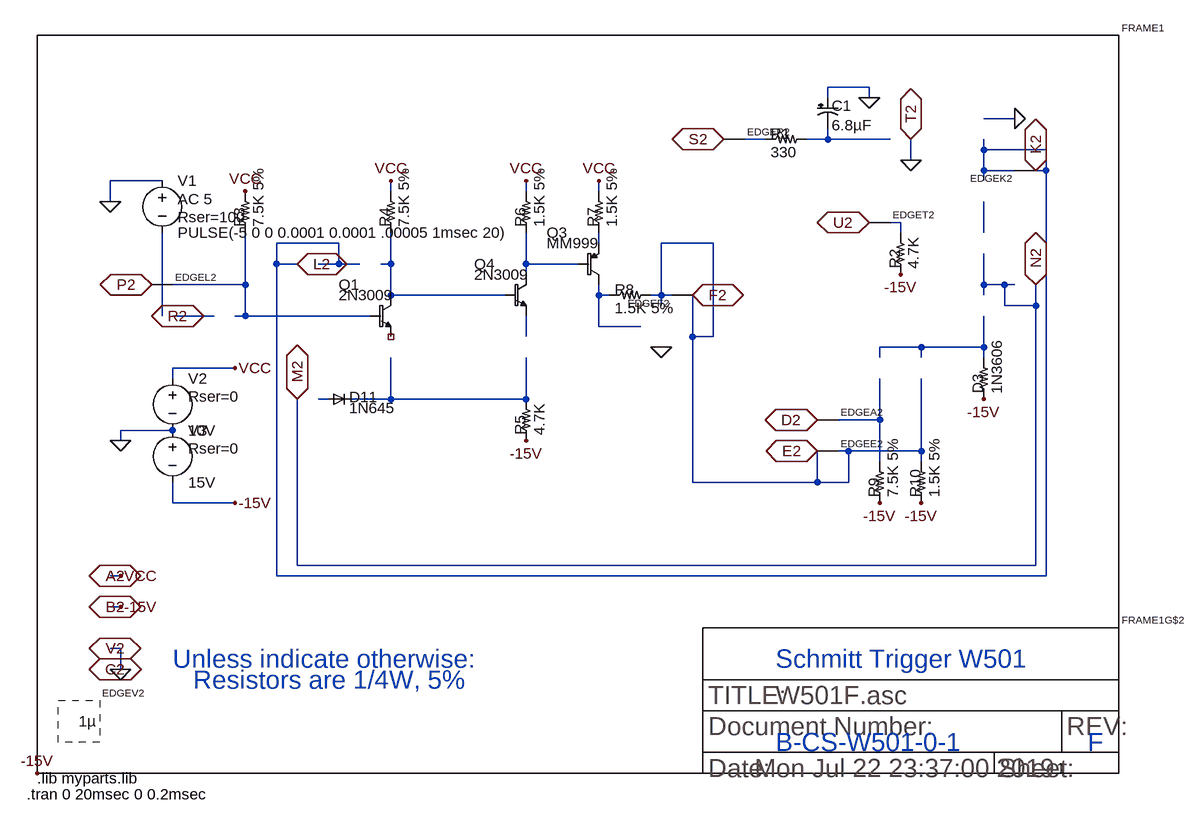
[diagram p0: schematic W501F.asc]
W501F.asc, the LTspice schematic file:
Version 4
SHEET 1 1916 48
WIRE 1280 -1056 1216 -1056
WIRE 1216 -1040 1216 -1056
WIRE 1280 -1040 1280 -1056
WIRE 1504 -1008 1456 -1008
WIRE 1120 -976 1088 -976
WIRE 1216 -976 1216 -992
WIRE 1216 -976 1184 -976
WIRE 1312 -976 1216 -976
WIRE 1456 -960 1456 -976
WIRE 1552 -960 1456 -960
WIRE 1344 -944 1344 -976
WIRE 1456 -928 1456 -960
WIRE 1504 -928 1456 -928
WIRE 1552 -928 1552 -960
WIRE 1552 -928 1536 -928
WIRE 192 -912 112 -912
WIRE 1456 -912 1456 -928
WIRE 544 -896 544 -912
WIRE 752 -896 752 -912
WIRE 864 -896 864 -912
WIRE 112 -880 112 -912
WIRE 1328 -848 1312 -848
WIRE 1328 -832 1328 -848
WIRE 1456 -832 1456 -880
WIRE 464 -816 368 -816
WIRE 864 -816 864 -832
WIRE 1040 -816 960 -816
WIRE 368 -784 368 -816
WIRE 400 -784 368 -784
WIRE 464 -784 464 -816
WIRE 464 -784 432 -784
WIRE 496 -784 464 -784
WIRE 544 -784 544 -832
WIRE 544 -784 528 -784
WIRE 752 -784 752 -832
WIRE 832 -784 752 -784
WIRE 752 -768 752 -784
WIRE 320 -752 320 -832
WIRE 320 -752 208 -752
WIRE 1456 -752 1456 -800
WIRE 1488 -752 1456 -752
WIRE 1504 -752 1488 -752
WIRE 544 -736 544 -784
WIRE 720 -736 544 -736
WIRE 864 -736 864 -752
WIRE 880 -736 864 -736
WIRE 960 -736 960 -816
WIRE 960 -736 944 -736
WIRE 976 -736 960 -736
WIRE 1456 -736 1456 -752
WIRE 960 -720 960 -736
WIRE 1488 -720 1488 -752
WIRE 1536 -720 1536 -752
WIRE 1536 -720 1488 -720
WIRE 192 -704 192 -832
WIRE 272 -704 208 -704
WIRE 320 -704 320 -752
WIRE 320 -704 304 -704
WIRE 512 -704 320 -704
WIRE 864 -688 864 -736
WIRE 928 -688 864 -688
WIRE 752 -672 752 -704
WIRE 1008 -672 1008 -736
WIRE 1040 -672 1040 -816
WIRE 1040 -672 1008 -672
WIRE 1360 -656 1296 -656
WIRE 1456 -656 1456 -704
WIRE 1456 -656 1360 -656
WIRE 1296 -640 1296 -656
WIRE 1360 -640 1360 -656
WIRE 1456 -640 1456 -656
WIRE 304 -624 208 -624
WIRE 208 -608 208 -624
WIRE 448 -576 432 -576
WIRE 544 -576 544 -640
WIRE 544 -576 480 -576
WIRE 752 -576 752 -640
WIRE 752 -576 544 -576
WIRE 1296 -544 1296 -608
WIRE 1296 -544 1232 -544
WIRE 208 -528 128 -528
WIRE 128 -512 128 -528
WIRE 1248 -496 1232 -496
WIRE 1360 -496 1360 -608
WIRE 1360 -496 1248 -496
WIRE 1296 -480 1296 -544
WIRE 1360 -480 1360 -496
WIRE 1008 -448 1008 -672
WIRE 1200 -448 1200 -496
WIRE 1200 -448 1008 -448
WIRE 1248 -448 1248 -496
WIRE 1248 -448 1200 -448
WIRE 208 -416 208 -448
WIRE 304 -416 208 -416
WIRE 400 -320 400 -576
WIRE 1536 -320 1536 -720
WIRE 1536 -320 400 -320
WIRE 128 -304 112 -304
WIRE 368 -304 368 -784
WIRE 1552 -304 1552 -928
WIRE 1552 -304 368 -304
WIRE 128 -256 112 -256
WIRE 128 -192 112 -192
WIRE 128 -160 128 -192
WIRE 128 -160 112 -160
FLAG 80 -192 V2
IOPIN 80 -192 BiDir
FLAG 1280 -848 U2
IOPIN 1280 -848 BiDir
FLAG 1344 -976 T2
IOPIN 1344 -976 BiDir
FLAG 1056 -976 S2
IOPIN 1056 -976 BiDir
FLAG 176 -704 R2
IOPIN 176 -704 BiDir
FLAG 176 -752 P2
IOPIN 176 -752 BiDir
FLAG 1536 -752 N2
IOPIN 1536 -752 BiDir
FLAG 400 -576 M2
IOPIN 400 -576 BiDir
FLAG 400 -784 L2
IOPIN 400 -784 BiDir
FLAG 1536 -928 K2
IOPIN 1536 -928 BiDir
FLAG 1008 -736 F2
IOPIN 1008 -736 BiDir
FLAG 1200 -496 E2
IOPIN 1200 -496 BiDir
FLAG 1200 -544 D2
IOPIN 1200 -544 BiDir
FLAG 80 -160 C2
IOPIN 80 -160 BiDir
FLAG 80 -256 B2
IOPIN 80 -256 BiDir
FLAG 80 -304 A2
IOPIN 80 -304 BiDir
FLAG 128 -304 VCC
FLAG 128 -256 -15V
FLAG 128 -160 0
FLAG 1328 -768 -15V
FLAG 752 -512 -15V
FLAG 1296 -416 -15V
FLAG 1360 -416 -15V
FLAG 1456 -576 -15V
FLAG 1280 -1040 0
FLAG 1504 -1008 0
FLAG 960 -656 0
FLAG 864 -912 VCC
FLAG 752 -912 VCC
FLAG 544 -912 VCC
FLAG 320 -896 VCC
FLAG 112 -880 0
FLAG 128 -512 0
FLAG 304 -624 VCC
FLAG 304 -416 -15V
FLAG 0 0 -15V
FLAG 1344 -944 0
SYMBOL DEVICE 64 -80 R0
SYMATTR InstName U$1
SYMATTR Value OUTLINE-SINGLE
SYMBOL EDGE-RIGHT 96 -192 MR180
SYMATTR InstName EDGEV2
SYMATTR Value 1µ
SYMBOL EDGE-RIGHT 1296 -848 R0
SYMATTR InstName EDGEU2
SYMATTR Value 1µ
SYMBOL EDGE-RIGHT 1328 -976 MR0
SYMATTR InstName EDGET2
SYMATTR Value 1µ
SYMBOL EDGE-RIGHT 1072 -976 R0
SYMATTR InstName EDGES2
SYMATTR Value 1µ
SYMBOL EDGE-RIGHT 192 -704 MR180
SYMATTR InstName EDGER2
SYMATTR Value 1µ
SYMBOL EDGE-RIGHT 192 -752 R0
SYMATTR InstName EDGEP2
SYMATTR Value 1µ
SYMBOL EDGE-RIGHT 1520 -752 MR0
SYMATTR InstName EDGEN2
SYMATTR Value 1µ
SYMBOL EDGE-RIGHT 416 -576 MR180
SYMATTR InstName EDGEM2
SYMATTR Value 1µ
SYMBOL EDGE-RIGHT 416 -784 MR180
SYMATTR InstName EDGEL2
SYMATTR Value 1µ
SYMBOL EDGE-RIGHT 1520 -928 R180
SYMATTR InstName EDGEK2
SYMATTR Value 1µ
SYMBOL EDGE-RIGHT 992 -736 R180
SYMATTR InstName EDGEF2
SYMATTR Value 1µ
SYMBOL EDGE-RIGHT 1216 -496 R0
SYMATTR InstName EDGEE2
SYMATTR Value 1µ
SYMBOL EDGE-RIGHT 1216 -544 R0
SYMATTR InstName EDGED2
SYMATTR Value 1µ
SYMBOL EDGE-RIGHT 96 -160 MR180
SYMATTR InstName EDGEC2
SYMATTR Value 1µ
SYMBOL EDGE-RIGHT 96 -256 MR180
SYMATTR InstName EDGEB2
SYMATTR Value 1µ
SYMBOL EDGE-RIGHT 96 -304 MR180
SYMATTR InstName EDGEA2
SYMATTR Value 1µ
SYMBOL DINA4_L 0 0 R0
SYMATTR InstName FRAME1
SYMBOL DOCFIELD 1024 0 R0
SYMATTR InstName FRAME1G$2
SYMATTR Value 1
SYMBOL NPN 528 -704 R0
SYMATTR InstName Q1
SYMATTR Value 2N3009
SYMBOL NPN 736 -736 R0
SYMATTR InstName Q2
SYMATTR Value 2N3009
SYMBOL NPN 944 -688 MR180
SYMATTR InstName Q4
SYMATTR Value 2N3009
SYMBOL PNP 848 -784 R0
SYMATTR InstName Q3
SYMATTR Value MM999
SYMBOL R-US 1152 -976 R0
SYMATTR InstName R1
SYMATTR Value 330
SYMBOL R-US 1328 -800 R270
SYMATTR InstName R2
SYMATTR Value 4.7K
SYMBOL R-US 320 -864 R270
SYMATTR InstName R3
SYMATTR Value 7.5K 5%
SYMBOL R-US 544 -864 R270
SYMATTR InstName R4
SYMATTR Value 7.5K 5%
SYMBOL R-US 752 -544 R270
SYMATTR InstName R5
SYMATTR Value 4.7K
SYMBOL R-US 752 -864 R270
SYMATTR InstName R6
SYMATTR Value 1.5K 5%
SYMBOL R-US 864 -864 R270
SYMATTR InstName R7
SYMATTR Value 1.5K 5%
SYMBOL R-US 912 -736 R0
SYMATTR InstName R8
SYMATTR Value 1.5K 5%
SYMBOL R-US 1296 -448 R270
SYMATTR InstName R9
SYMATTR Value 7.5K 5%
SYMBOL R-US 1360 -448 R270
SYMATTR InstName R10
SYMATTR Value 1.5K 5%
SYMBOL R-US 1456 -608 R270
SYMATTR InstName R11
SYMATTR Value 1.5K 5%
SYMBOL D 544 -656 MR90
SYMATTR InstName D2
SYMATTR Value 1N3606
SYMBOL D 512 -784 MR0
SYMATTR InstName D3
SYMATTR Value 1N3606
SYMBOL D 464 -576 R0
SYMATTR InstName D4
SYMATTR Value 1N3606
SYMBOL D 752 -656 MR90
SYMATTR InstName D5
SYMATTR Value 1N3606
SYMBOL D 1296 -624 MR90
SYMATTR InstName D6
SYMATTR Value 1N3606
SYMBOL D 1360 -624 MR90
SYMATTR InstName D7
SYMATTR Value 1N3606
SYMBOL D 1456 -992 MR90
SYMATTR InstName D8
SYMATTR Value 1N645
SYMBOL D 288 -704 MR0
SYMATTR InstName D1
SYMATTR Value 1N3606
SYMBOL D 1456 -896 MR90
SYMATTR InstName D9
SYMATTR Value 1N645
SYMBOL D 1456 -816 MR90
SYMATTR InstName D10
SYMATTR Value 1N645
SYMBOL D 1456 -720 MR90
SYMATTR InstName D11
SYMATTR Value 1N645
SYMBOL CPOL-US 1216 -1024 R0
SYMATTR InstName C1
SYMATTR Value 6.8µF
SYMBOL voltage 192 -928 R0
WINDOW 123 24 44 Left 2
WINDOW 39 24 72 Left 2
SYMATTR Value2 AC 5
SYMATTR SpiceLine Rser=100
SYMATTR InstName V1
SYMATTR Value PULSE(-5 0 0 0.0001 0.0001 .00005 1msec 20)
SYMBOL voltage 208 -624 R0
WINDOW 123 0 0 Left 2
WINDOW 39 24 44 Left 2
SYMATTR InstName V2
SYMATTR Value 10V
SYMATTR SpiceLine Rser=0
SYMBOL voltage 208 -544 R0
WINDOW 123 0 0 Left 2
WINDOW 39 24 44 Left 2
SYMATTR InstName V3
SYMATTR Value 15V
SYMATTR SpiceLine Rser=0
TEXT 1136 -176 Left 4 ;Schmitt Trigger W501
TEXT 240 -144 Left 4 ;Resistors are 1/4W, 5%
TEXT 1136 -48 Left 4 ;B-CS-W501-0-1
TEXT 1616 -48 Left 4 ;F
TEXT 208 -176 Left 4 ;Unless indicate otherwise:
TEXT 0 8 Left 2 !.lib myparts.lib
TEXT -16 32 Left 2 !.tran 0 20msec 0 0.2msec

The netlist it stands for:
* W501F.asc
-§EDGEV2 1µ
R§EDGET2 N003 U2 1µ
R§EDGER2 N001 S2 1µ
R§EDGEL2 N008 P2 1µ
R§EDGEK2 K2 K2 1µ
R§EDGEF2 E2 E2 1µ
R§EDGEE2 E2 E2 1µ
R§EDGEA2 N016 D2 1µ
-§FRAME1 DINA4_L
-§FRAME1G$2 1
Q1 N008 NC_01 N006 0 2N3009
Q4 N006 N012 N007 0 2N3009
Q3 N007 N005 N009 0 MM999
R1 N002 N001 330
R2 N003 -15V 4.7K
R3 VCC N008 7.5K 5%
R4 VCC N006 7.5K 5%
R5 N015 -15V 4.7K
R6 VCC N007 1.5K 5%
R7 VCC N005 1.5K 5%
R8 E2 N009 1.5K 5%
R9 N016 -15V 7.5K 5%
R10 E2 -15V 1.5K 5%
R§D3 N013 -15V 1N3606
D11 N014 N015 1N645
C1 0 N002 6.8µF
V1 0 N010 PULSE(-5 0 0 0.0001 0.0001 .00005 1msec 20) AC 5 Rser=100
V2 VCC 0 10V Rser=0
V3 0 -15V 15V Rser=0
.model D D
.lib standard.dio
.model NPN NPN
.model PNP PNP
.lib standard.bjt
* Schmitt Trigger W501
* Resistors are 1/4W, 5%
* B-CS-W501-0-1
* F
* Unless indicate otherwise:
.lib myparts.lib
.tran 0 20msec 0 0.2msec
.backanno
.end